# EAGLE design board (EAGLE 6.4)
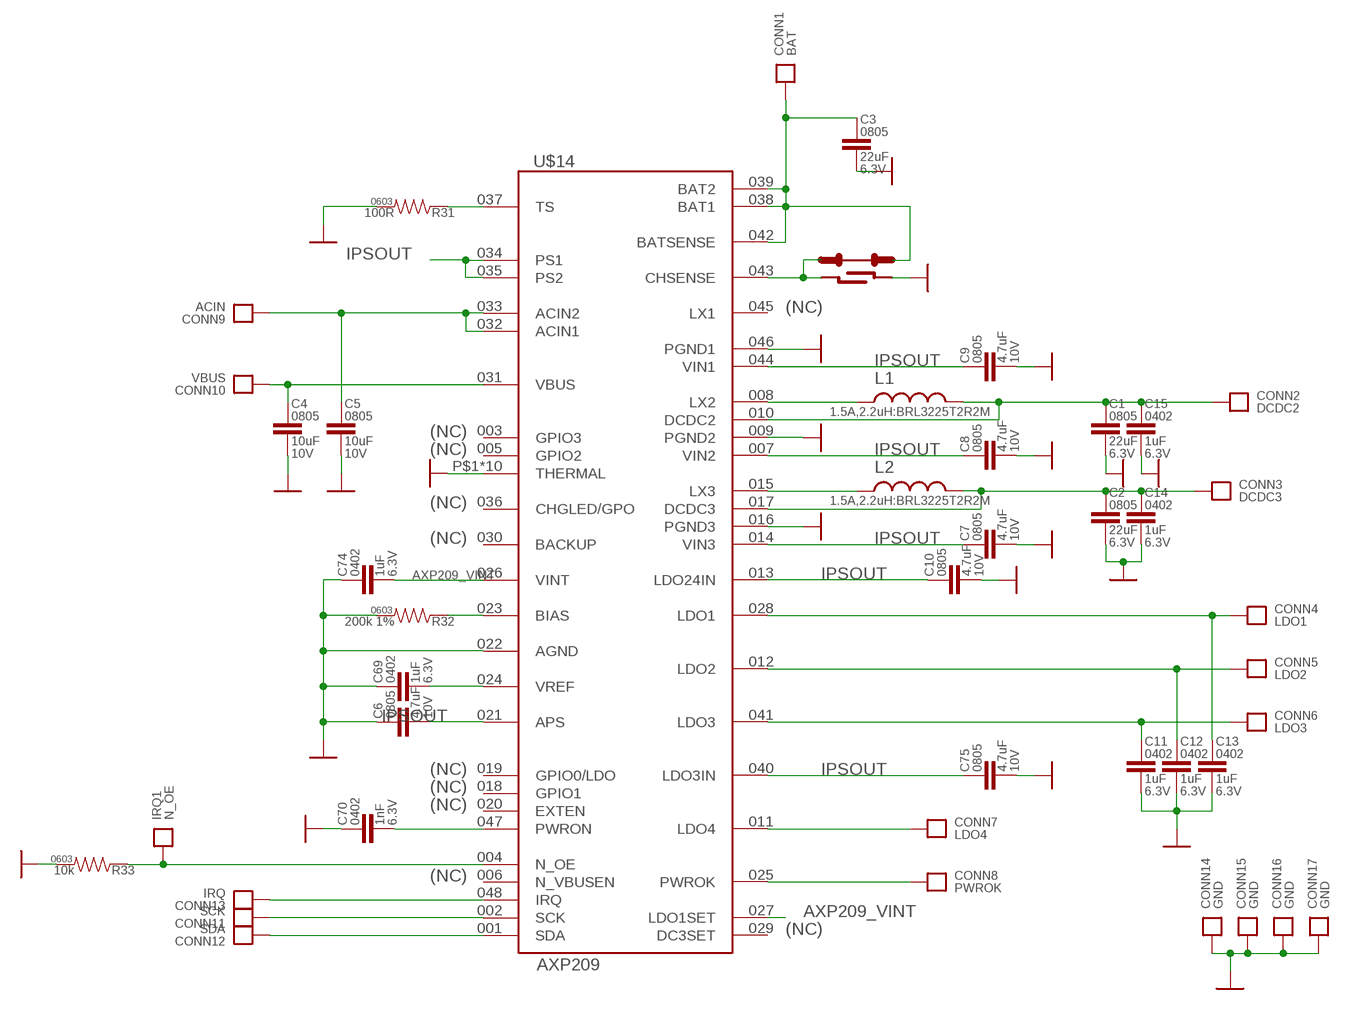
[diagram p0: schematic, sheet 1]

## Parts
C1  22uF  CAP0805  [0805]
C2  22uF  CAP0805  [0805]
C3  22uF  CAP0805  [0805]
C4  10uF  CAP0805  [0805]
C5  10uF  CAP0805  [0805]
C6  4.7uF  CAP0805  [0805]
C7  4.7uF  CAP0805  [0805]
C8  4.7uF  CAP0805  [0805]
C9  4.7uF  CAP0805  [0805]
C10  4.7uF  CAP0805  [0805]
C11  1uF  CAP0402-CAP  [0402-CAP]
C12  1uF  CAP0402-CAP  [0402-CAP]
C13  1uF  CAP0402-CAP  [0402-CAP]
C14  1uF  CAP0402-CAP  [0402-CAP]
C15  1uF  CAP0402-CAP  [0402-CAP]
C69  1uF  CAP0402-CAP  [0402-CAP]
C70  1nF  CAP0402-CAP  [0402-CAP]
C74  1uF  CAP0402-CAP  [0402-CAP]
C75  4.7uF  CAP0805  [0805]
CONN1  BAT  CONNECTOR22AWG  [HOLE_22AWG]
CONN2  DCDC2  CONNECTOR22AWG  [HOLE_22AWG]
CONN3  DCDC3  CONNECTOR22AWG  [HOLE_22AWG]
CONN4  LDO1  CONNECTOR22AWG  [HOLE_22AWG]
CONN5  LDO2  CONNECTOR22AWG  [HOLE_22AWG]
CONN6  LDO3  CONNECTOR22AWG  [HOLE_22AWG]
CONN7  LDO4  CONNECTOR22AWG  [HOLE_22AWG]
CONN8  PWROK  CONNECTOR22AWG  [HOLE_22AWG]
CONN9  ACIN  CONNECTOR22AWG  [HOLE_22AWG]
CONN10  VBUS  CONNECTOR22AWG  [HOLE_22AWG]
CONN11  SCK  CONNECTOR22AWG  [HOLE_22AWG]
CONN12  SDA  CONNECTOR22AWG  [HOLE_22AWG]
CONN13  IRQ  CONNECTOR22AWG  [HOLE_22AWG]
CONN14  GND  CONNECTOR22AWG  [HOLE_22AWG]
CONN15  GND  CONNECTOR22AWG  [HOLE_22AWG]
CONN16  GND  CONNECTOR22AWG  [HOLE_22AWG]
CONN17  GND  CONNECTOR22AWG  [HOLE_22AWG]
IRQ1  N_OE  CONNECTOR22AWG  [HOLE_22AWG]
L1  1.5A,2.2uH:BRL3225T2R2M  INDUCTOR1206  [1206]
L2  1.5A,2.2uH:BRL3225T2R2M  INDUCTOR1206  [1206]
R31  100R  RESISTOR0603  [0603-RES]
R32  200k 1%  RESISTOR0603  [0603-RES]
R33  10k  RESISTOR0603  [0603-RES]
SB7  SOLDER-BRIDGEOPEN  [SOLDER-BRIDGE-OPEN]
SB8  TRACE-CUT  [TRACE-CUT]
U$14  AXP209  [QFN48]

## Nets
AXP209_NOE: IRQ1.P R33.1 U$14.004(N_OE)
AXP209_VINT: C74.2 U$14.026(VINT) U$14.027(LDO1SET)
GND: C1.2 C2.2 C3.2 C4.2 C5.2 C6.1 C7.2 C8.2 C9.2 C10.2 C11.2 C12.2 C13.2 C14.2 C15.2 C69.1 C70.1 C74.1 C75.2 CONN14.P CONN15.P CONN16.P CONN17.P R31.2 R32.2 R33.2 SB7.L1 SB7.L2 U$14.009(PGND2) U$14.016(PGND3) U$14.022(AGND) U$14.046(PGND1) U$14.P$1(THERMAL) U$14.P$2(THERMAL) U$14.P$3(THERMAL) U$14.P$4(THERMAL) U$14.P$5(THERMAL) U$14.P$6(THERMAL) U$14.P$7(THERMAL) U$14.P$8(THERMAL) U$14.P$9(THERMAL) U$14.PAD(THERMAL)
IPSOUT: C6.2 C7.1 C8.1 C9.1 C10.1 C75.1 U$14.007(VIN2) U$14.013(LDO24IN) U$14.014(VIN3) U$14.021(APS) U$14.034(PS1) U$14.035(PS2) U$14.040(LDO3IN) U$14.044(VIN1)
LDO1: C13.1 CONN4.P U$14.028(LDO1)
LDO2: C12.1 CONN5.P U$14.012(LDO2)
LDO3: C11.1 CONN6.P U$14.041(LDO3)
LDO4: CONN7.P U$14.011(LDO4)
N$1: C3.1 CONN1.P SB8.R1 U$14.038(BAT1) U$14.039(BAT2) U$14.042(BATSENSE)
N$2: L1.1 U$14.008(LX2)
N$3: C1.1 C15.1 CONN2.P L1.2 U$14.010(DCDC2)
N$4: L2.1 U$14.015(LX3)
N$5: C2.1 C14.1 CONN3.P L2.2 U$14.017(DCDC3)
N$6: CONN13.P U$14.048(IRQ)
N$7: CONN11.P U$14.002(SCK)
N$8: CONN12.P U$14.001(SDA)
N$9: CONN8.P U$14.025(PWROK)
N$84: C69.2 U$14.024(VREF)
N$90: R31.1 U$14.037(TS)
N$99: C5.1 CONN9.P U$14.032(ACIN1) U$14.033(ACIN2)
N$100: C4.1 CONN10.P U$14.031(VBUS)
N$101: R32.1 U$14.023(BIAS)
N$102: C70.2 U$14.047(PWRON)
N$104: SB7.R1 SB7.R2 SB8.L1 U$14.043(CHSENSE)
Unconnected: U$14.003(GPIO3) U$14.005(GPIO2) U$14.006(N_VBUSEN) U$14.018(GPIO1) U$14.019(GPIO0/LDO) U$14.020(EXTEN) U$14.029(DC3SET) U$14.030(BACKUP) U$14.036(CHGLED/GPO) U$14.045(LX1)

## Notes on the sheet
- (NC)
- (NC)
- (NC)
- (NC)
- (NC)
- (NC)
- (NC)
- (NC)
- (NC)
- (NC)

## Library data of the parts
C1-C3 = kmod-passives:CAP: Capacitor Standard 0603 ceramic capacitor, and 0.1" leaded capacitor.; PACKAGE: 0805; VOLTAGE: 6.3V
C4-C10 C75 = kmod-passives:CAP: Capacitor Standard 0603 ceramic capacitor, and 0.1" leaded capacitor.; PACKAGE: 0805; VOLTAGE: 10V
C11-C15 C69 C70 C74 = kmod-passives:CAP: Capacitor Standard 0603 ceramic capacitor, and 0.1" leaded capacitor.; PACKAGE: 0402; VOLTAGE: 6.3V
CONN1-CONN17 IRQ1 = kmod-nonparts:CONNECTOR: Collection of holes/pads for testing/connecting
L1 L2 = kmod-passives:INDUCTOR
R31-R33 = kmod-passives:RESISTOR: Resistor Basic schematic elements and footprints for 0603, 1206, and PTH resistors.; PACKAGE: 0603
SB7 = kmod-nonparts:SOLDER-BRIDGE
SB8 = kmod-nonparts:TRACE-CUT
U$14 = kmod-testing:AXP209

## Board
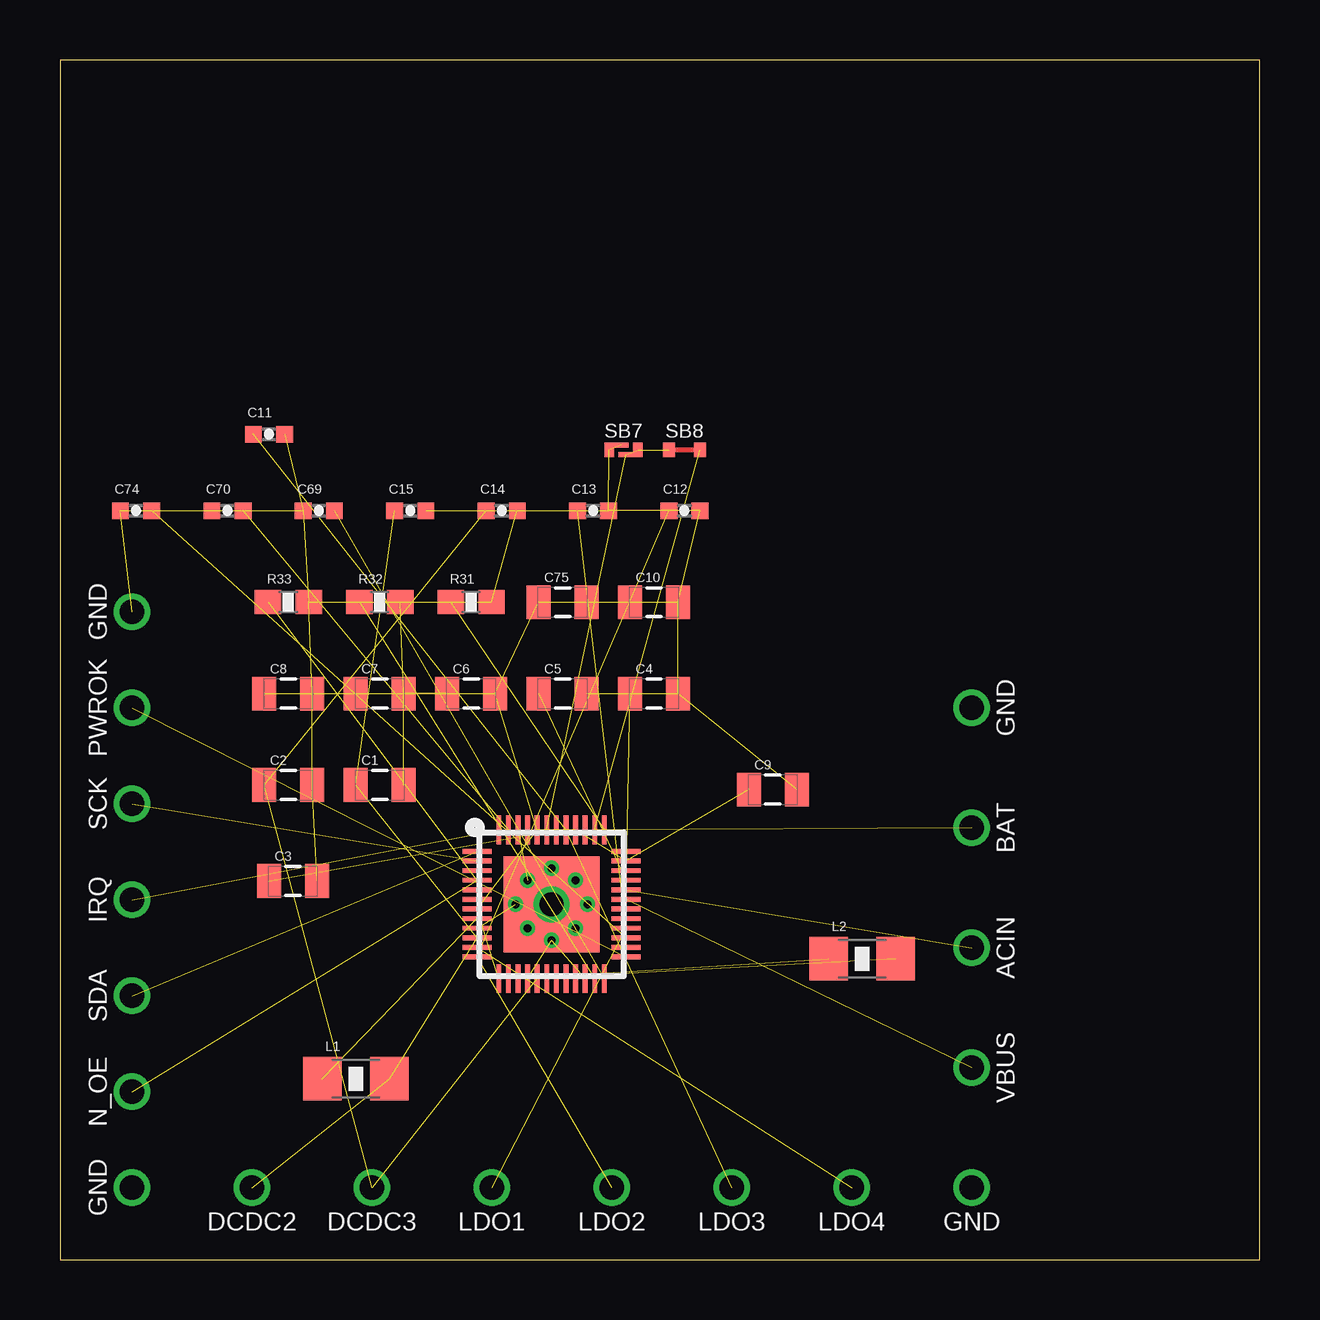
[diagram p1: board, top side]
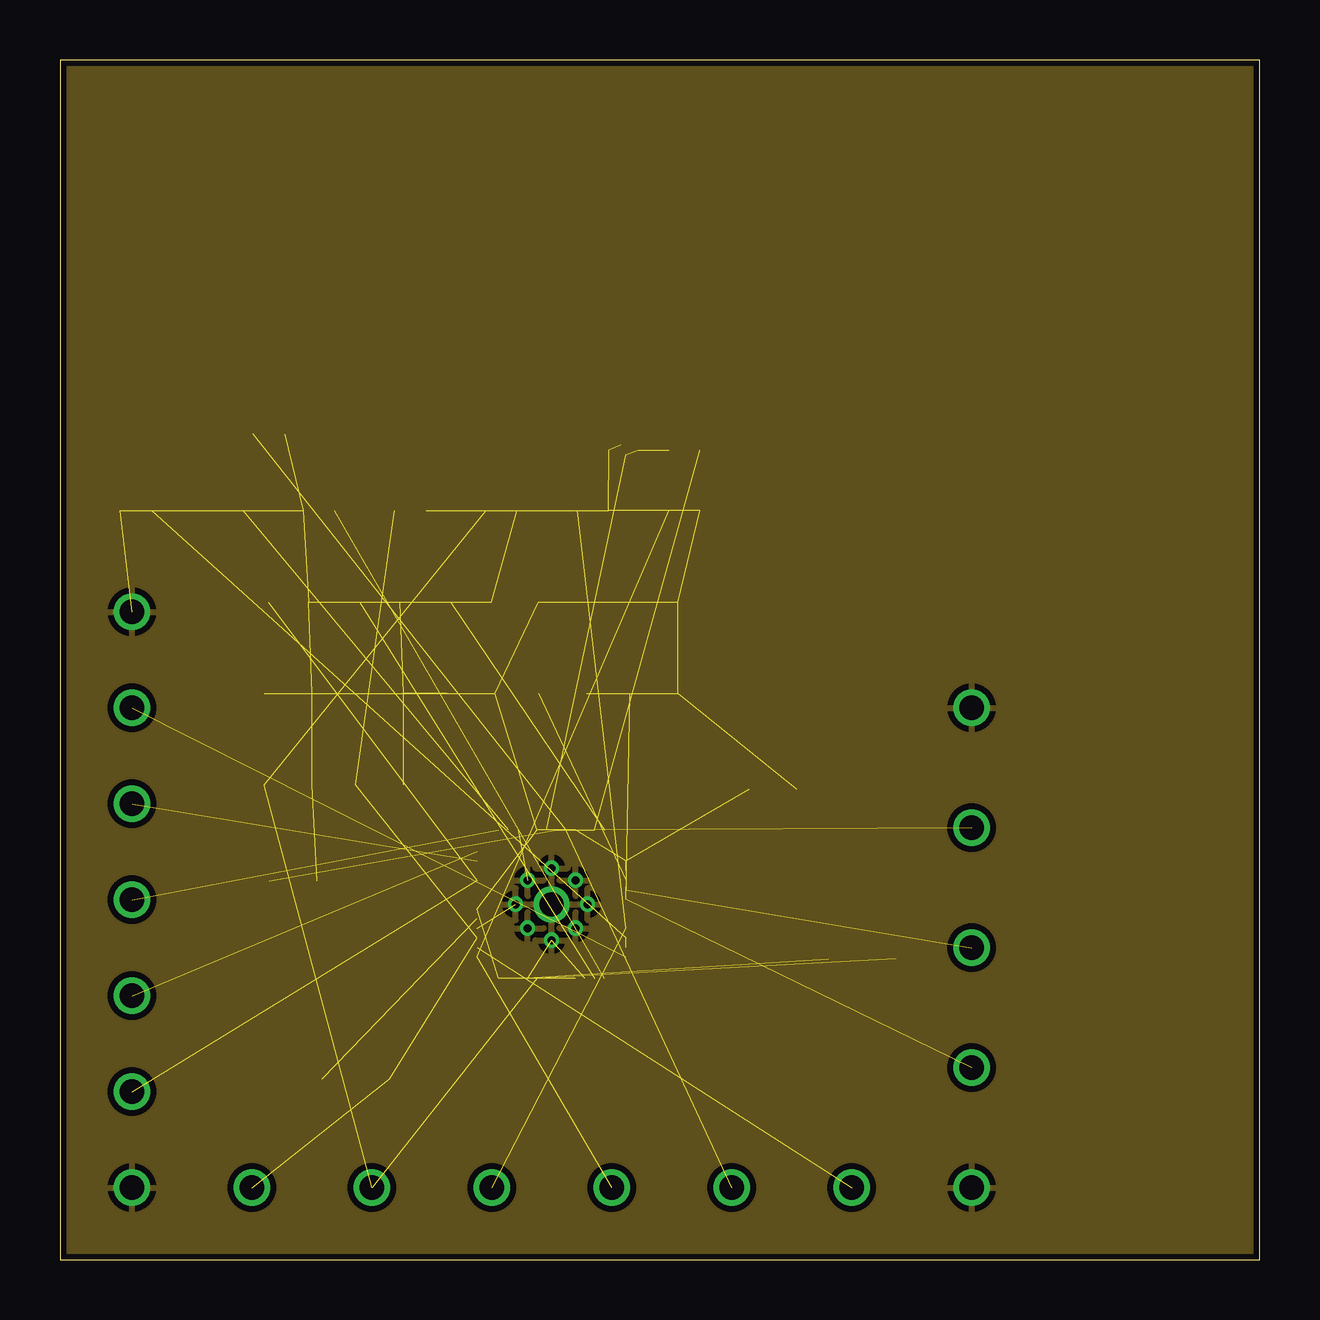
[diagram p2: board, inner layer Route2]
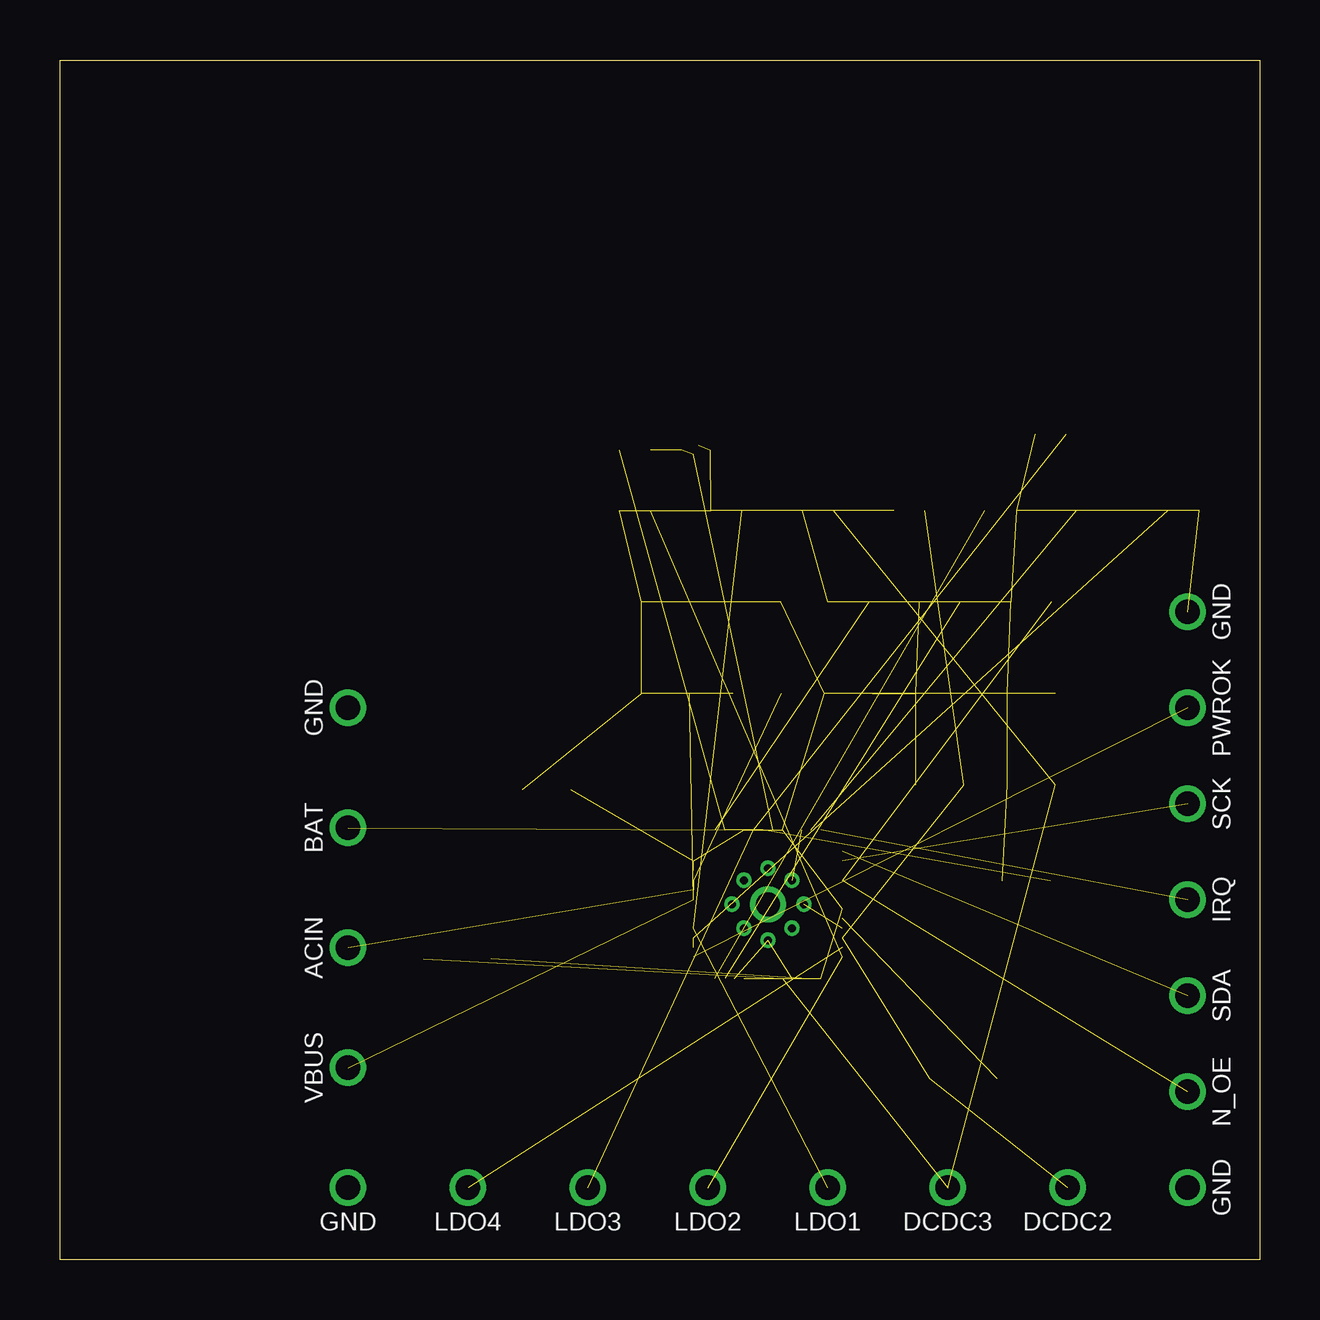
[diagram p3: board, bottom side, seen from below]

Size 50 x 50 mm. Coordinates in mm from the lower left corner, seen from the top.
Outline: 0,0 50,0 50,50 0,50 0,0
Copper layers (1*2*15*16): Top 0.035mm / dielectric 0.2mm / Route2 0.0175mm / dielectric 0.3mm / Route15 0.0175mm / dielectric 0.2mm / Bottom 0.035mm
Design rules "my_SeeedStudio_4layer_DRU_no_angle_20140221": minimum track width 6mil, minimum drill 12mil, track to track 6mil, track to pad 6mil, pad to pad 6mil, via to via 6mil, smd to smd 6mil, copper to edge 10mil, drill to drill 10mil, minimum pad ring 6mil, minimum via ring 6mil, stop-mask expansion 2mil, vias tented up to drill 12mil, thermal gap 10mil

### Footprints (pad centres in the part's own frame; a part is rotated, then mirrored left to right if it is on the bottom)
0805 = smd 1 x 1.4: 1 -1,0; 2 1,0
0402-CAP = smd 0.7 x 0.7: 1 -0.65,0; 2 0.65,0
HOLE_22AWG = drill 1.016: P 0,0
1206 = smd 1.6 x 1.8: 1 -1.4,0; 2 1.4,0
0603-RES = smd 1.1 x 1: 1 -0.85,0; 2 0.85,0
SOLDER-BRIDGE-OPEN = smd 0.4 x 0.6: L1 -0.6,0; R1 0.6,0 | smd 0.6 x 0.2: L2 -0.1,0.2; R2 0.1,-0.2
TRACE-CUT = smd 0.5 x 0.6: L1 -0.65,0; R1 0.65,0
QFN48 = smd 1.2 x 0.2: 001 -3.1,2.2; 002 -3.1,1.8; 003 -3.1,1.4; 004 -3.1,1; 005 -3.1,0.6; 006 -3.1,0.2; 007 -3.1,-0.2; 008 -3.1,-0.6; 009 -3.1,-1; 010 -3.1,-1.4; 011 -3.1,-1.8; 012 -3.1,-2.2; 025 3.1,-2.2; 026 3.1,-1.8; 027 3.1,-1.4; 028 3.1,-1; 029 3.1,-0.6; 030 3.1,-0.2; 031 3.1,0.2; 032 3.1,0.6; 033 3.1,1; 034 3.1,1.4; 035 3.1,1.8; 036 3.1,2.2 | smd 0.2 x 1.2: 013 -2.2,-3.1; 014 -1.8,-3.1; 015 -1.4,-3.1; 016 -1,-3.1; 017 -0.6,-3.1; 018 -0.2,-3.1; 019 0.2,-3.1; 020 0.6,-3.1; 021 1,-3.1; 022 1.4,-3.1; 023 1.8,-3.1; 024 2.2,-3.1; 037 2.2,3.1; 038 1.8,3.1; 039 1.4,3.1; 040 1,3.1; 041 0.6,3.1; 042 0.2,3.1; 043 -0.2,3.1; 044 -0.6,3.1; 045 -1,3.1; 046 -1.4,3.1; 047 -1.8,3.1; 048 -2.2,3.1 | drill 0.33: P$1 -1,1; P$2 1,1; P$3 1,-1; P$4 -1,-1; P$6 1.5,0; P$7 0,-1.5; P$8 -1.5,0; P$9 0,1.5 | drill 1: P$5 0,0 | smd 4 x 4: PAD 0,0

### Placement (x,y rotation side)
C1  13.33,19.78 0 top
C2  9.52,19.78 0 top
C3  9.71,15.78 0 top
C4  24.76,23.59 0 top
C5  20.95,23.59 0 top
C6  17.14,23.59 0 top
C7  13.33,23.59 0 top
C8  9.52,23.59 0 top
C9  29.71,19.59 0 top
C10  24.76,27.4 0 top
C11  8.71,34.4 0 top
C12  26.03,31.21 0 top
C13  22.22,31.21 0 top
C14  18.41,31.21 0 top
C15  14.6,31.21 0 top
C69  10.79,31.21 0 top
C70  6.98,31.21 0 top
C74  3.17,31.21 0 top
C75  20.95,27.4 0 top
CONN1  38,18 90 top
CONN2  8,3 0 top
CONN3  13,3 0 top
CONN4  18,3 0 top
CONN5  23,3 0 top
CONN6  28,3 0 top
CONN7  33,3 0 top
CONN8  3,23 270 top
CONN9  38,13 90 top
CONN10  38,8 90 top
CONN11  3,19 270 top
CONN12  3,11 270 top
CONN13  3,15 270 top
CONN14  38,23 90 top
CONN15  3,3 270 top
CONN16  38,3 0 top
CONN17  3,27 270 top
IRQ1  3,7 270 top
L1  12.33,7.54 0 top
L2  33.44,12.54 0 top
R31  17.14,27.4 0 top
R32  13.33,27.4 0 top
R33  9.52,27.4 0 top
SB7  23.49,33.75 0 top
SB8  26.03,33.75 0 top
U$14  20.49,14.81 0 top

### Tracks (layer width: path | path; a pad name or v marks a point on that pad's centre or on a via)
AXP209_NOE  (2 unrouted)
AXP209_VINT  (2 unrouted)
GND  (28 unrouted)
  pour Route2 (isolate 0.254): -2,52 52,52 52,-2 -2,-2
IPSOUT  (13 unrouted)
LDO1  (2 unrouted)
LDO2  (2 unrouted)
LDO3  (2 unrouted)
LDO4  (1 unrouted)
N$1  (5 unrouted)
N$2  (1 unrouted)
N$3  (4 unrouted)
N$4  (1 unrouted)
N$5  (4 unrouted)
N$6  (1 unrouted)
N$7  (1 unrouted)
N$8  (1 unrouted)
N$9  (1 unrouted)
N$84  (1 unrouted)
N$90  (1 unrouted)
N$99  (3 unrouted)
N$100  (2 unrouted)
N$101  (1 unrouted)
N$102  (1 unrouted)
N$104  (3 unrouted)